# Altium project МПСУ-46342.21-004.PrjPcb
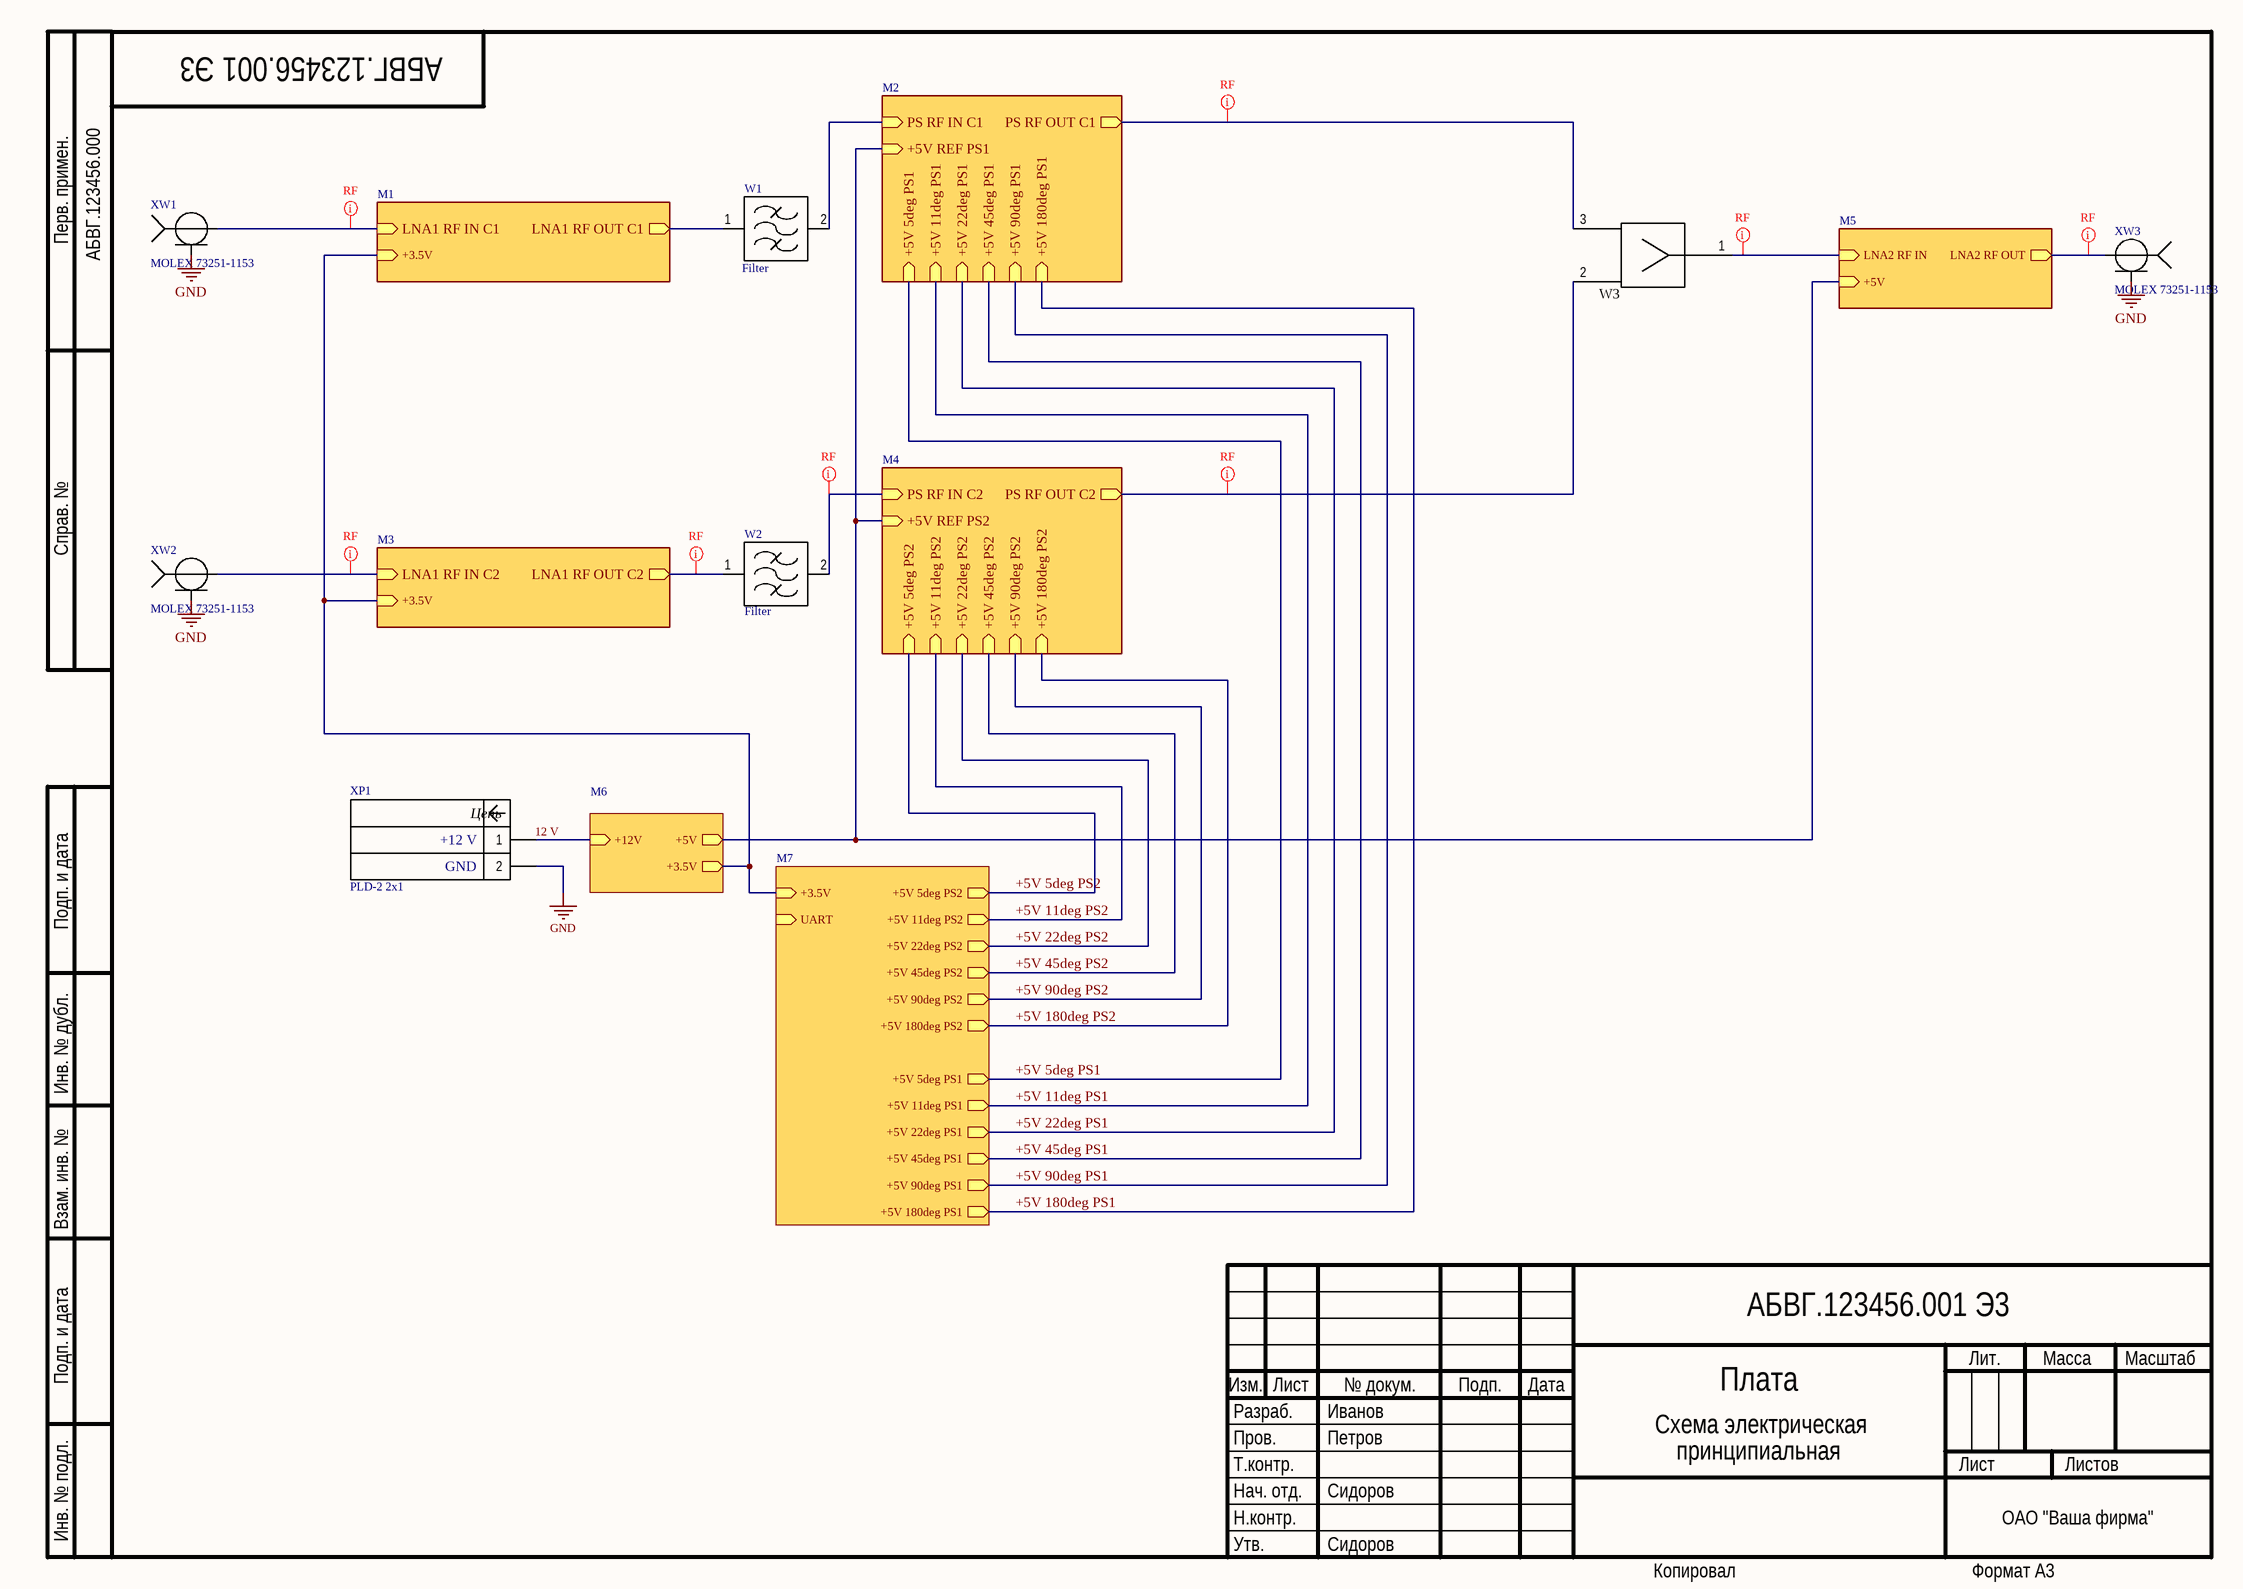
[diagram p0: МПСУ-46342.21-004 Э3 Лист1.SchDoc]
8 sheets, 65 parts. Net scope: hierarchical (ports join the sheet entries above them; power ports are global).
Board file: МПСУ-46342.21-004 Т5М.PcbDoc
Sheets:
  МПСУ-46342.21-004 Э3 Лист1.SchDoc
    M2 = МПСУ-46342.21-004 Э3 Лист4.SchDoc
    M5 = МПСУ-46342.21-004 Э3 Лист3.SchDoc
    M3 = МПСУ-46342.21-004 Э3 Лист7.SchDoc
    M4 = МПСУ-46342.21-004 Э3 Лист8.SchDoc
    M6 = МПСУ-46342.21-004 Э3 Лист5.SchDoc
    M1 = МПСУ-46342.21-004 Э3 Лист2.SchDoc
    M7 = МПСУ-46342.21-004 Э3 Лист6.SchDoc

## Sheet МПСУ-46342.21-004 Э3 Лист1.SchDoc
size 420 x 297 mm; Address1: Address1; Address2: Address2; Address3: Address3; Address4: Address4; SheetNumber: 1; Scale: 1:1; Разраб.: Иванов; Обозначение документа: АБВГ.123456.001 Э3; Пров.: Петров; Утв.: Сидоров; Наименование организации: ОАО "Ваша фирма"; Перв. применение: АБВГ.123456.000; Наименование изделия 1: Плата; Наименование изделия 2: Схема электрическая; Наименование изделия 3: принципиальная; Нач. отд.: Нач. отд.; Фамилия нач. отд.: Сидоров

### Parts
W1  Filter  [Filter]
W2  Filter  [Filter]  (net tie, no BOM)
W3  Wilkinson Coupler  [CouplerWilk]  (value not drawn)  (net tie, no BOM)
XP1  PLD-2 2x1  Net1: +12 V  Net2: GND  [HDRV2W64P254_1X2_254X508H884]
XW1  MOLEX 73251-1153  [MOLEX 73251-1153 - 1.1pin]
XW2  MOLEX 73251-1153  [MOLEX 73251-1153 - 1.1pin]
XW3  MOLEX 73251-1153  [MOLEX 73251-1153 - 1.1pin]

### Sub-sheets
M1 = МПСУ-46342.21-004 Э3 Лист2.SchDoc: +3.5V (in), LNA1 RF IN C1 (in), LNA1 RF OUT C1 (out)
M2 = МПСУ-46342.21-004 Э3 Лист4.SchDoc: PS RF IN C1 (in), PS RF OUT C1 (out), +5V 90deg PS1 (in), +5V 11deg PS1 (in), +5V 45deg PS1 (in), +5V 180deg PS1 (in), +5V REF PS1 (in), +5V 5deg PS1 (in), +5V 22deg PS1 (in)
M3 = МПСУ-46342.21-004 Э3 Лист7.SchDoc: +3.5V (in), LNA1 RF IN C2 (in), LNA1 RF OUT C2 (out)
M4 = МПСУ-46342.21-004 Э3 Лист8.SchDoc: PS RF OUT C2 (out), PS RF IN C2 (in), +5V 5deg PS2 (in), +5V 180deg PS2 (in), +5V 11deg PS2 (in), +5V REF PS2 (in), +5V 22deg PS2 (in), +5V 45deg PS2 (in), +5V 90deg PS2 (in)
M5 = МПСУ-46342.21-004 Э3 Лист3.SchDoc: LNA2 RF IN (in), LNA2 RF OUT (out), +5V (in)
M6 = МПСУ-46342.21-004 Э3 Лист5.SchDoc: +5V (out), +12V (in), +3.5V (out)
M7 = МПСУ-46342.21-004 Э3 Лист6.SchDoc: +3.5V (in), +5V 11deg PS2 (out), +5V 45deg PS1 (out), +5V 90deg PS1 (out), +5V 180deg PS1 (out), +5V 180deg PS2 (out), +5V 5deg PS1 (out), +5V 45deg PS2 (out), +5V 90deg PS2 (out), +5V 5deg PS2 (out), +5V 11deg PS1 (out), +5V 22deg PS1 (out), +5V 22deg PS2 (out), UART (in)

### Nets
GND: XP1.2 XW1.2 XW2.2 XW3.2
12 V: XP1.1 ; sheet M6/+12V
+3.5V: sheet M3/+3.5V, sheet M6/+3.5V, sheet M1/+3.5V, sheet M7/+3.5V
+5V: sheet M2/+5V REF PS1, sheet M5/+5V, sheet M4/+5V REF PS2, sheet M6/+5V
+5V 5deg PS1: sheet M2/+5V 5deg PS1, sheet M7/+5V 5deg PS1
+5V 5deg PS2: sheet M4/+5V 5deg PS2, sheet M7/+5V 5deg PS2
+5V 11deg PS1: sheet M2/+5V 11deg PS1, sheet M7/+5V 11deg PS1
+5V 11deg PS2: sheet M4/+5V 11deg PS2, sheet M7/+5V 11deg PS2
+5V 22deg PS1: sheet M2/+5V 22deg PS1, sheet M7/+5V 22deg PS1
+5V 22deg PS2: sheet M4/+5V 22deg PS2, sheet M7/+5V 22deg PS2
+5V 45deg PS1: sheet M2/+5V 45deg PS1, sheet M7/+5V 45deg PS1
+5V 45deg PS2: sheet M4/+5V 45deg PS2, sheet M7/+5V 45deg PS2
+5V 90deg PS1: sheet M2/+5V 90deg PS1, sheet M7/+5V 90deg PS1
+5V 90deg PS2: sheet M4/+5V 90deg PS2, sheet M7/+5V 90deg PS2
+5V 180deg PS1: sheet M2/+5V 180deg PS1, sheet M7/+5V 180deg PS1
+5V 180deg PS2: sheet M4/+5V 180deg PS2, sheet M7/+5V 180deg PS2
LNA1 RF IN C1: XW1.1 ; sheet M1/LNA1 RF IN C1
LNA1 RF IN C2: XW2.1 ; sheet M3/LNA1 RF IN C2
LNA1 RF OUT C1: W1.1 ; sheet M1/LNA1 RF OUT C1
LNA1 RF OUT C2: W2.1 ; sheet M3/LNA1 RF OUT C2
LNA2 RF IN: W3.1 ; sheet M5/LNA2 RF IN
LNA2 RF OUT: XW3.1 ; sheet M5/LNA2 RF OUT
PS RF IN C1: W1.2 ; sheet M2/PS RF IN C1
PS RF IN C2: W2.2 ; sheet M4/PS RF IN C2
PS RF OUT C1: W3.3 ; sheet M2/PS RF OUT C1
PS RF OUT C2: W3.2 ; sheet M4/PS RF OUT C2

### Layout directives
net class RF: LNA1 RF IN C1, LNA1 RF IN C2, LNA1 RF OUT C2, LNA2 RF IN, LNA2 RF OUT, PS RF IN C2, PS RF OUT C1, PS RF OUT C2

### Notes on the sheet
- Перв. примен.
- Справ. №
- Подп. и дата
- Инв. № дубл.
- Взам. инв. №
- Разраб.
- Изм.
- Лист
- № докум.
- Подп.
- Дата
- Лит.
- Масса
- Масштаб
- Пров.
- Т.контр.
- Листов
- Инв. № подл.
- Утв.
- Н.контр.
- Копировал
- Формат А3
- (in symbol PLD-2) Цепь

### Library data of the parts
W3 = CouplerWilk: Wilkinson Coupler diel 7.2GHz, RO4003, h=0.2mm
XP1 = PLD-2: Header, Vertical, Non-shrouded, 2.54 mm pitch 2x1; PartNumber: PLD-2 2x1
XW1-XW3 = MOLEX 73251-1153: MOLEX 73251-1153 (SMA EDGE); PartNumber: MOLEX 73251-1153; Manufacturer: Molex; ClassName: GNDDirect

## Sheet МПСУ-46342.21-004 Э3 Лист4.SchDoc
size 209 x 297 mm; Address1: Address1; Address2: Address2; Address3: Address3; Address4: Address4; SheetNumber: 1; Scale: 1:1; Разраб.: Иванов; Обозначение документа: АБВГ.123456.001 Э3; Пров.: Петров; Утв.: Сидоров; Наименование организации: ОАО "Ваша фирма"; Перв. применение: АБВГ.123456.000; Наименование изделия 1: Плата; Наименование изделия 2: Схема электрическая; Наименование изделия 3: принципиальная; Нач. отд.: Нач. отд.; Фамилия нач. отд.: Сидоров
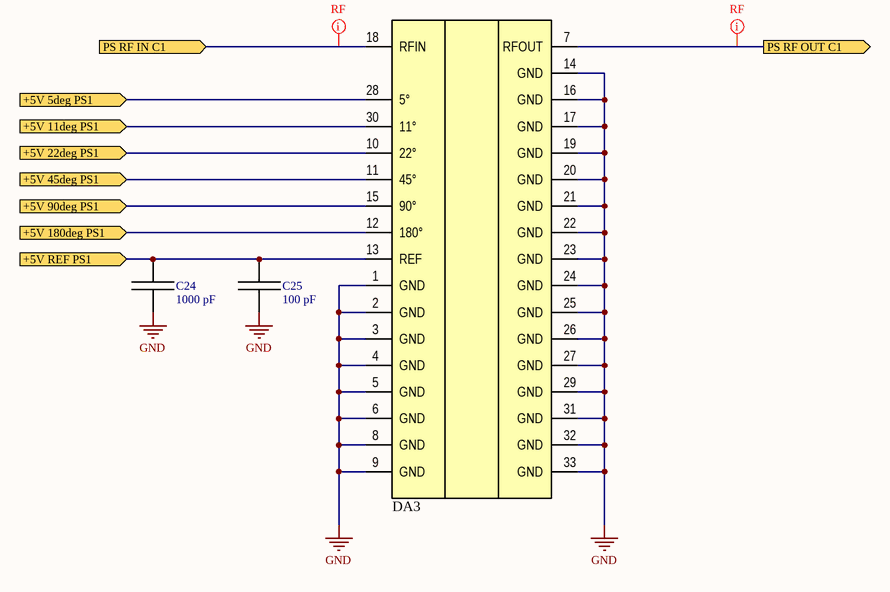
[diagram p1: МПСУ-46342.21-004 Э3 Лист4.SchDoc]

### Parts
C24  1000 pF  [CAPC100X50X55L20N]
C25  100 pF  [CAPC100X50X55L20N]
DA3  TGP2105-SM  [QFN33P50_500X500X80L46X25T340N]  (value not drawn)

### Ports
+5V 5deg PS1 (in), +5V 11deg PS1 (in), +5V 22deg PS1 (in), +5V 45deg PS1 (in), +5V 90deg PS1 (in), +5V 180deg PS1 (in), +5V REF PS1 (in), PS RF IN C1 (in), PS RF OUT C1 (out)

### Nets
GND: C24.1 C25.1 DA3.1(GND) DA3.2(GND) DA3.3(GND) DA3.4(GND) DA3.5(GND) DA3.6(GND) DA3.8(GND) DA3.9(GND) DA3.14(GND) DA3.16(GND) DA3.17(GND) DA3.19(GND) DA3.20(GND) DA3.21(GND) DA3.22(GND) DA3.23(GND) DA3.24(GND) DA3.25(GND) DA3.26(GND) DA3.27(GND) DA3.29(GND) DA3.31(GND) DA3.32(GND) DA3.33(GND)
+5V: C24.2 C25.2 DA3.13(REF) ; port +5V REF PS1
+5V 5deg PS1: DA3.28(5°) ; port +5V 5deg PS1
+5V 11deg PS1: DA3.30(11°) ; port +5V 11deg PS1
+5V 22deg PS1: DA3.10(22°) ; port +5V 22deg PS1
+5V 45deg PS1: DA3.11(45°) ; port +5V 45deg PS1
+5V 90deg PS1: DA3.15(90°) ; port +5V 90deg PS1
+5V 180deg PS1: DA3.12(180°) ; port +5V 180deg PS1
PS RF IN C1: DA3.18(RFIN) ; port PS RF IN C1
PS RF OUT C1: DA3.7(RFOUT) ; port PS RF OUT C1

### Layout directives
net class RF: PS RF IN C1, PS RF OUT C1

### Notes on the sheet
- Перв. примен.
- Справ. №
- Подп. и дата
- Инв. № дубл.
- Взам. инв. №
- Разраб.
- Изм.
- Лист
- № докум.
- Подп.
- Дата
- Лит.
- Масса
- Масштаб
- Пров.
- Т.контр.
- Листов
- Инв. № подл.
- Утв.
- Н.контр.
- Копировал
- Формат А4

### Library data of the parts
C24 C25 = Capacitor: Capacitor, generic; Tolerance: 5 %; VDC: 20 V; PartNumber: *; Dielectric: *; Manufacturer: *; Package: 0402
  C24: Value: 1000 pF
  C25: Value: 100 pF
DA3 = TGP2105-SM 1: 6 - 18 GHz 6-Bit Digital Phase Shifter (+Vc); Manufacturer: Qorvo; PartNumber: TGP2105-SM; ComponentLink1Description: Component Page; ComponentLink1URL: https://www.qorvo.com/products/p/TGP2105-SM

## Sheet МПСУ-46342.21-004 Э3 Лист3.SchDoc
size 297 x 209 mm; Разраб.: Муренков; Пров.: Приходько; Утв.: Приходько; Наименование организации: МПСУ; Наименование изделия 1: Приёмная ячейка; Наименование изделия 2: Схема электрическая; Наименование изделия 3: принципиальная; Нач. отд.: Нач. отд.; Фамилия нач. отд.: Лялин; Address1: Address1; Address2: Address2; Address3: Address3; Address4: Address4; SheetNumber: 3; Scale: 1:1; Обозначение документа: МПСУ-46342.21-004 Э3
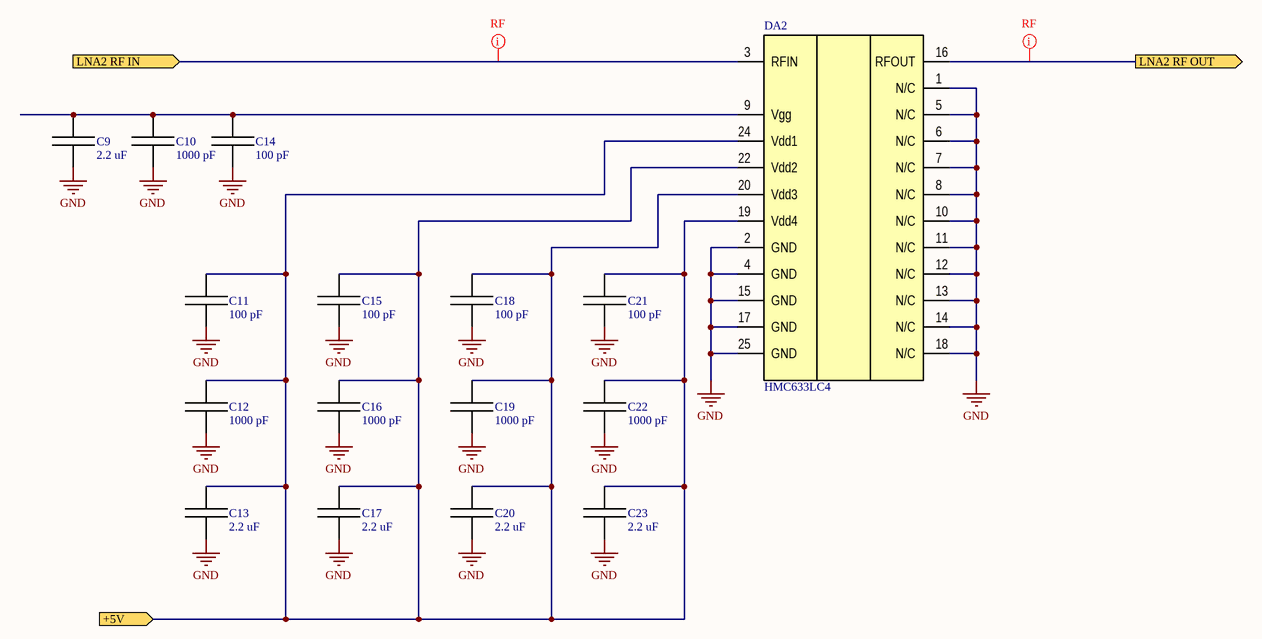
[diagram p2: МПСУ-46342.21-004 Э3 Лист3.SchDoc]

### Parts
C9  2.2 uF  [CAPC100X50X55L20N]
C10  1000 pF  [CAPC100X50X55L20N]
C11  100 pF  [CAPC100X50X55L20N]
C12  1000 pF  [CAPC100X50X55L20N]
C13  2.2 uF  [CAPC160X80X90L30N]
C14  100 pF  [CAPC100X50X55L20N]
C15  100 pF  [CAPC100X50X55L20N]
C16  1000 pF  [CAPC100X50X55L20N]
C17  2.2 uF  [CAPC160X80X90L30N]
C18  100 pF  [CAPC100X50X55L20N]
C19  1000 pF  [CAPC100X50X55L20N]
C20  2.2 uF  [CAPC160X80X90L30N]
C21  100 pF  [CAPC100X50X55L20N]
C22  1000 pF  [CAPC100X50X55L20N]
C23  2.2 uF  [CAPC160X80X90L30N]
DA2  HMC633LC4  [PQFN25P50_390X390X100L32X30T250N]

### Ports
+5V (in), LNA2 RF IN (in), LNA2 RF OUT (out)

### Nets
GND: C9.1 C10.1 C11.1 C12.1 C13.1 C14.1 C15.1 C16.1 C17.1 C18.1 C19.1 C20.1 C21.1 C22.1 C23.1 DA2.1(N/C) DA2.2(GND) DA2.4(GND) DA2.5(N/C) DA2.6(N/C) DA2.7(N/C) DA2.8(N/C) DA2.10(N/C) DA2.11(N/C) DA2.12(N/C) DA2.13(N/C) DA2.14(N/C) DA2.15(GND) DA2.17(GND) DA2.18(N/C) DA2.25(GND)
+5V: C11.2 C12.2 C13.2 C15.2 C16.2 C17.2 C18.2 C19.2 C20.2 C21.2 C22.2 C23.2 DA2.19(Vdd4) DA2.20(Vdd3) DA2.22(Vdd2) DA2.24(Vdd1) ; port +5V
LNA2 RF IN: DA2.3(RFIN) ; port LNA2 RF IN
LNA2 RF OUT: DA2.16(RFOUT) ; port LNA2 RF OUT
NetC9_2: C9.2 C10.2 C14.2 DA2.9(Vgg)

### Layout directives
net class RF: LNA2 RF IN, LNA2 RF OUT

### Notes on the sheet
- Подп. и дата
- Инв. № дубл.
- Взам. инв. №
- Инв. № подл.
- Изм.
- Лист
- № докум.
- Подп.
- Дата
- Копировал
- Формат А4

### Library data of the parts
C9-C23 = Capacitor: as C24 on sheet МПСУ-46342.21-004 Э3 Лист4; PartNumber: *; Dielectric: *; Manufacturer: *
  C9: Value: 2.2 uF; Package: 0402
  C10 C12 C16 C19 C22: Value: 1000 pF; Package: 0402
  C11 C14 C15 C18 C21: Value: 100 pF; Package: 0402
  C13 C17 C20 C23: Value: 2.2 uF; Package: 0603
DA2 = HMC633LC4: GaAs, pHEMT MMIC DRIVERAMPLIFIER, 5.5 - 17 GHz; Manufacturer: Analog Devices; ComponentLink1Description: Component page; ComponentLink1URL: https://www.analog.com/en/products/hmc633lc4.html; PartNumber: HMC633LC4; ClassName: RFCons

## Sheet МПСУ-46342.21-004 Э3 Лист7.SchDoc
size 297 x 209 mm; Address1: Address1; Address2: Address2; Address3: Address3; Address4: Address4; SheetNumber: 1; DocumentTypeSCH: Э3
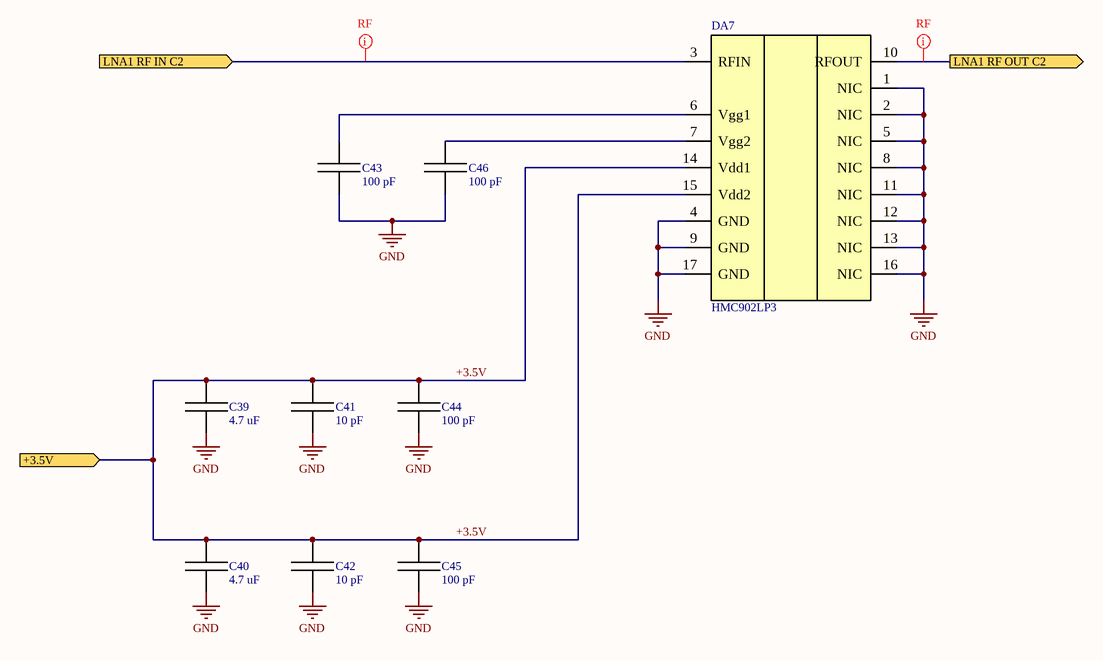
[diagram p3: МПСУ-46342.21-004 Э3 Лист7.SchDoc]

### Parts
C39  4.7 uF  [CAPC160X80X90L30N]
C40  4.7 uF  [CAPC160X80X90L30N]
C41  10 pF  [CAPC100X50X55L20N]
C42  10 pF  [CAPC100X50X55L20N]
C43  100 pF  [CAPC100X50X55L20N]
C44  100 pF  [CAPC100X50X55L20N]
C45  100 pF  [CAPC100X50X55L20N]
C46  100 pF  [CAPC100X50X55L20N]
DA7  HMC902LP3  [QFN17P50_300X300X90L40X25T170N]

### Ports
+3.5V (in), LNA1 RF IN C2 (in), LNA1 RF OUT C2 (out)

### Nets
GND: C39.1 C40.1 C41.1 C42.1 C43.1 C44.1 C45.1 C46.1 DA7.1(NIC) DA7.2(NIC) DA7.4(GND) DA7.5(NIC) DA7.8(NIC) DA7.9(GND) DA7.11(NIC) DA7.12(NIC) DA7.13(NIC) DA7.16(NIC) DA7.17(GND)
+3.5V: C39.2 C40.2 C41.2 C42.2 C44.2 C45.2 DA7.14(Vdd1) DA7.15(Vdd2) ; port +3.5V
LNA1 RF IN C2: DA7.3(RFIN) ; port LNA1 RF IN C2
LNA1 RF OUT C2: DA7.10(RFOUT) ; port LNA1 RF OUT C2
NetC43_2: C43.2 DA7.6(Vgg1)
NetC46_2: C46.2 DA7.7(Vgg2)

### Layout directives
net class RF: LNA1 RF IN C2, LNA1 RF OUT C2

### Notes on the sheet
- Подп. и дата
- Инв. № дубл.
- Взам. инв. №
- Инв. № подл.
- Изм.
- Лист
- № докум.
- Подп.
- Дата
- Копировал
- Формат А4

### Library data of the parts
C39 C40 C43-C46 = Capacitor: as C24 on sheet МПСУ-46342.21-004 Э3 Лист4; PartNumber: *; Dielectric: *; Manufacturer: *
  C39: Value: 4.7 uF; Package: 0603
  C40: Value: 4.7 uF; Package: 0402
  C43-C46: Value: 100 pF; Package: 0402
C41 C42 = Capacitor: Capacitor, generic; Value: 0.01 nF; Tolerance: 5 %; VDC: 20 V; PartNumber: *; Dielectric: *; Manufacturer: *; Package: 0402
DA7 = HMC902LP3: GaAs, pHEMT, MMIC, Low Noise Amplifier, 5 GHz to 11 GHz; Manufacturer: Analog Devices; ComponentLink1Description: Component page; ComponentLink1URL: https://www.analog.com/en/products/hmc902lp3e.html; PartNumber: HMC902LP3; ClassName: RFCons

## Sheet МПСУ-46342.21-004 Э3 Лист8.SchDoc
size 297 x 209 mm; Address1: Address1; Address2: Address2; Address3: Address3; Address4: Address4; SheetNumber: 1; DocumentTypeSCH: Э3
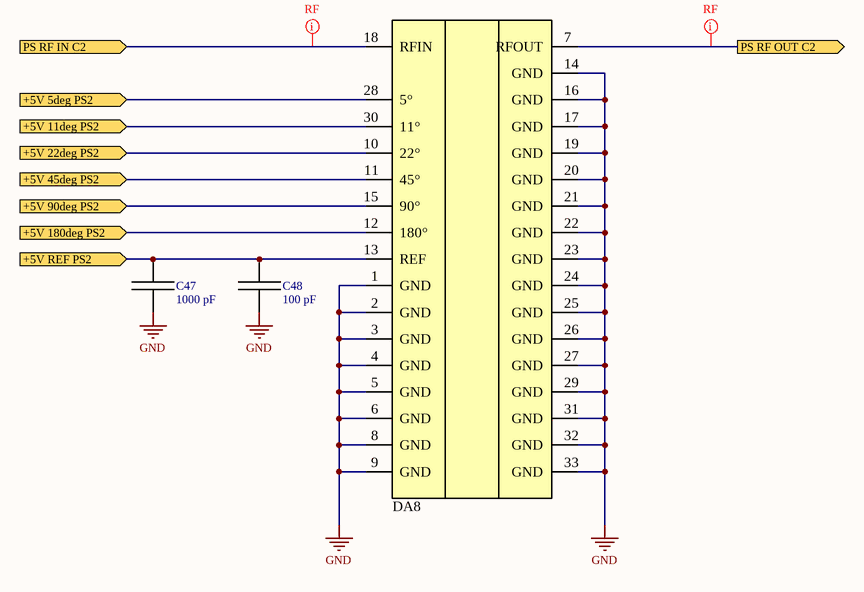
[diagram p4: МПСУ-46342.21-004 Э3 Лист8.SchDoc]

### Parts
C47  1000 pF  [CAPC100X50X55L20N]
C48  100 pF  [CAPC100X50X55L20N]
DA8  TGP2105-SM  [QFN33P50_500X500X80L46X25T340N]  (value not drawn)

### Ports
+5V 5deg PS2 (in), +5V 11deg PS2 (in), +5V 22deg PS2 (in), +5V 45deg PS2 (in), +5V 90deg PS2 (in), +5V 180deg PS2 (in), +5V REF PS2 (in), PS RF IN C2 (in), PS RF OUT C2 (out)

### Nets
GND: C47.1 C48.1 DA8.1(GND) DA8.2(GND) DA8.3(GND) DA8.4(GND) DA8.5(GND) DA8.6(GND) DA8.8(GND) DA8.9(GND) DA8.14(GND) DA8.16(GND) DA8.17(GND) DA8.19(GND) DA8.20(GND) DA8.21(GND) DA8.22(GND) DA8.23(GND) DA8.24(GND) DA8.25(GND) DA8.26(GND) DA8.27(GND) DA8.29(GND) DA8.31(GND) DA8.32(GND) DA8.33(GND)
+5V: C47.2 C48.2 DA8.13(REF) ; port +5V REF PS2
+5V 5deg PS2: DA8.28(5°) ; port +5V 5deg PS2
+5V 11deg PS2: DA8.30(11°) ; port +5V 11deg PS2
+5V 22deg PS2: DA8.10(22°) ; port +5V 22deg PS2
+5V 45deg PS2: DA8.11(45°) ; port +5V 45deg PS2
+5V 90deg PS2: DA8.15(90°) ; port +5V 90deg PS2
+5V 180deg PS2: DA8.12(180°) ; port +5V 180deg PS2
PS RF IN C2: DA8.18(RFIN) ; port PS RF IN C2
PS RF OUT C2: DA8.7(RFOUT) ; port PS RF OUT C2

### Layout directives
net class RF: PS RF IN C2, PS RF OUT C2

### Notes on the sheet
- Подп. и дата
- Инв. № дубл.
- Взам. инв. №
- Инв. № подл.
- Изм.
- Лист
- № докум.
- Подп.
- Дата
- Копировал
- Формат А4

### Library data of the parts
C47 C48 = Capacitor: as C24 on sheet МПСУ-46342.21-004 Э3 Лист4; PartNumber: *; Dielectric: *; Manufacturer: *; Package: 0402
  C47: Value: 1000 pF
  C48: Value: 100 pF
DA8 = TGP2105-SM 1: as DA3 on sheet МПСУ-46342.21-004 Э3 Лист4; PartNumber: TGP2105-SM; ComponentLink1Description: Component Page; ComponentLink1URL: https://www.qorvo.com/products/p/TGP2105-SM

## Sheet МПСУ-46342.21-004 Э3 Лист5.SchDoc
size 209 x 297 mm; Address1: Address1; Address2: Address2; Address3: Address3; Address4: Address4; SheetNumber: 1; Scale: 1:1; Разраб.: Муренков; Обозначение документа: МПСУ-46342.21-004 Э3; Пров.: Приходько; Номер листа: 1; Общее количество листов: 2; Литера: У; Наименование организации: МПСУ; Наименование изделия 1: Приёмная ячейка; Наименование изделия 2: Схема электрическая; Наименование изделия 3: принципиальная; Нач. отд.: Нач. отд.; Фамилия нач. отд.: Лялин
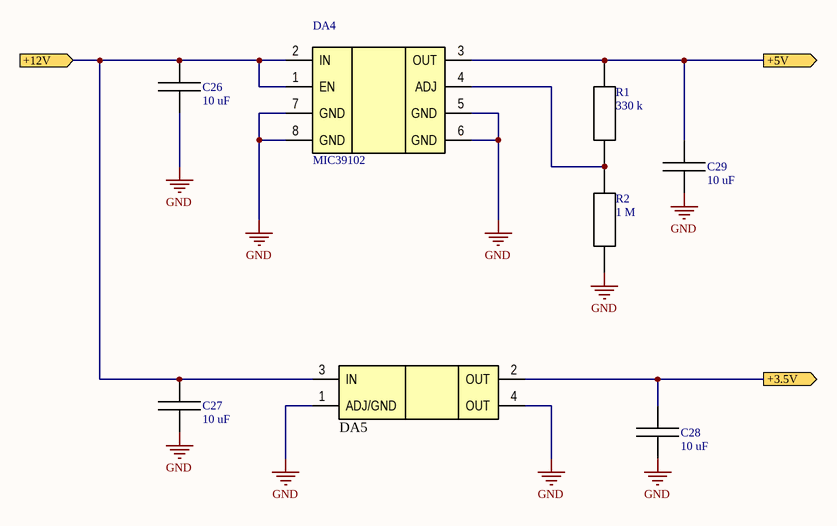
[diagram p5: МПСУ-46342.21-004 Э3 Лист5.SchDoc]

### Parts
C26  10 uF  [CAPC100X50X55L20N]
C27  10 uF  [CAPC100X50X55L20N]
C28  10 uF  [CAPC100X50X55L20N]
C29  10 uF  [CAPC100X50X55L20N]
DA4  MIC39102  [SOIC127P600X160-8N]
DA5  NCP1117LPST50T3G  [SOT223-4P230_700X180L92X74N]  (value not drawn)
R1  330 k  [RESC100X50X40L25N]
R2  1 M  [RESC100X50X40L25N]

### Ports
+3.5V (out), +5V (out), +12V (in)

### Nets
GND: C26.1 C27.1 C28.1 C29.1 DA4.5(GND) DA4.6(GND) DA4.7(GND) DA4.8(GND) DA5.1(ADJ/GND) DA5.4(OUT) R2.1
12 V: C26.2 C27.2 DA4.1(EN) DA4.2(IN) DA5.3(IN) ; port +12V
+3.5V: C28.2 DA5.2(OUT) ; port +3.5V
+5V: C29.2 DA4.3(OUT) R1.2 ; port +5V
NetDA4_4: DA4.4(ADJ) R1.1 R2.2

### Notes on the sheet
- Перв. примен.
- Справ. №
- Подп. и дата
- Инв. № дубл.
- Взам. инв. №
- Разраб.
- Изм.
- Лист
- № докум.
- Подп.
- Дата
- Лит.
- Масса
- Масштаб
- Пров.
- Т.контр.
- Листов
- Инв. № подл.
- Утв.
- Н.контр.
- Копировал
- Формат А4
- (in symbol MIC39102) Text

### Library data of the parts
C26-C29 = Capacitor: as C24 on sheet МПСУ-46342.21-004 Э3 Лист4; Value: 10 uF; PartNumber: *; Dielectric: *; Manufacturer: *; Package: 0402
DA4 = MIC39102: 1A Low-Voltage Low-Dropout Regulator, Adj; Manufacturer: Microchip; PartNumber: MIC39102
DA5 = NCP1117LP: 1.0 A Low-Dropout Positive / Fixed and Adjustable / Voltage Regulators; Manufacturer: On Semiconductor; PartNumber: NCP1117LPST50T3G
R1 = Resistor: Resistor, generic; Value: 330 k; PartNumber: *; Tolerance: *; Power: *; DCV: *; Manufacturer: *; Package: 0402
R2 = Resistor: Resistor, generic; Tolerance: 5 %; Power: 20 V; Value: 1 M; PartNumber: *; DCV: *; Manufacturer: *; Package: 0402

## Sheet МПСУ-46342.21-004 Э3 Лист2.SchDoc
size 297 x 209 mm; Address1: Address1; Address2: Address2; Address3: Address3; Address4: Address4; SheetNumber: 2; Scale: 1:1; Обозначение документа: МПСУ-46342.21-004 Э3
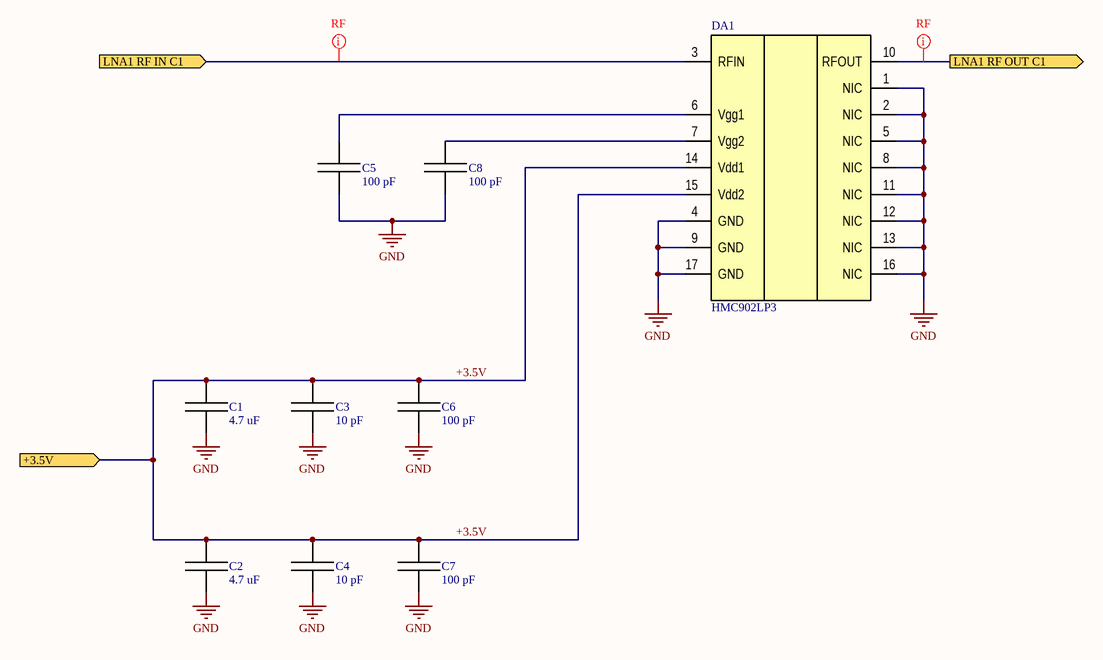
[diagram p6: МПСУ-46342.21-004 Э3 Лист2.SchDoc]

### Parts
C1  4.7 uF  [CAPC160X80X90L30N]
C2  4.7 uF  [CAPC160X80X90L30N]
C3  10 pF  [CAPC100X50X55L20N]
C4  10 pF  [CAPC100X50X55L20N]
C5  100 pF  [CAPC100X50X55L20N]
C6  100 pF  [CAPC100X50X55L20N]
C7  100 pF  [CAPC100X50X55L20N]
C8  100 pF  [CAPC100X50X55L20N]
DA1  HMC902LP3  [QFN17P50_300X300X90L40X25T170N]

### Ports
+3.5V (in), LNA1 RF IN C1 (in), LNA1 RF OUT C1 (out)

### Nets
GND: C1.1 C2.1 C3.1 C4.1 C5.1 C6.1 C7.1 C8.1 DA1.1(NIC) DA1.2(NIC) DA1.4(GND) DA1.5(NIC) DA1.8(NIC) DA1.9(GND) DA1.11(NIC) DA1.12(NIC) DA1.13(NIC) DA1.16(NIC) DA1.17(GND)
+3.5V: C1.2 C2.2 C3.2 C4.2 C6.2 C7.2 DA1.14(Vdd1) DA1.15(Vdd2) ; port +3.5V
LNA1 RF IN C1: DA1.3(RFIN) ; port LNA1 RF IN C1
LNA1 RF OUT C1: DA1.10(RFOUT) ; port LNA1 RF OUT C1
NetC5_2: C5.2 DA1.6(Vgg1)
NetC8_2: C8.2 DA1.7(Vgg2)

### Layout directives
net class RF: LNA1 RF IN C1, LNA1 RF OUT C1

### Notes on the sheet
- Подп. и дата
- Инв. № дубл.
- Взам. инв. №
- Инв. № подл.
- Изм.
- Лист
- № докум.
- Подп.
- Дата
- Копировал
- Формат А4

### Library data of the parts
C1 C2 C5-C8 = Capacitor: as C24 on sheet МПСУ-46342.21-004 Э3 Лист4; PartNumber: *; Dielectric: *; Manufacturer: *
  C1: Value: 4.7 uF; Package: 0603
  C2: Value: 4.7 uF; Package: 0402
  C5-C8: Value: 100 pF; Package: 0402
C3 C4 = Capacitor: as C41 on sheet МПСУ-46342.21-004 Э3 Лист7; PartNumber: *; Dielectric: *; Manufacturer: *; Package: 0402
DA1 = HMC902LP3: as DA7 on sheet МПСУ-46342.21-004 Э3 Лист7; ComponentLink1Description: Component page; ComponentLink1URL: https://www.analog.com/en/products/hmc902lp3e.html; PartNumber: HMC902LP3; ClassName: RFCons

## Sheet МПСУ-46342.21-004 Э3 Лист6.SchDoc
size 297 x 209 mm; Address1: Address1; Address2: Address2; Address3: Address3; Address4: Address4; SheetNumber: 1; Scale: 1:1; Обозначение документа: АБВГ.123456.001 Э3
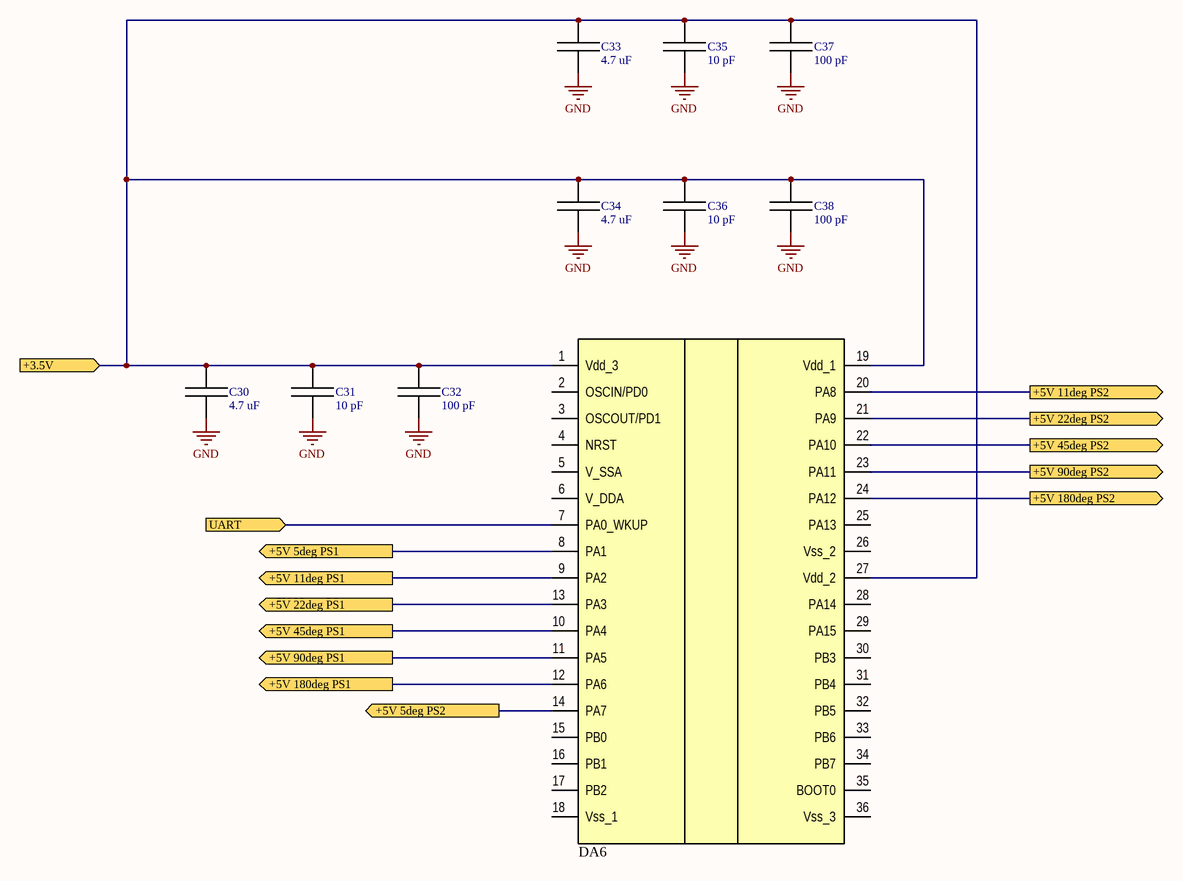
[diagram p7: МПСУ-46342.21-004 Э3 Лист6.SchDoc]

### Parts
C30  4.7 uF  [CAPC100X50X55L20N]
C31  10 pF  [CAPC100X50X55L20N]
C32  100 pF  [CAPC100X50X55L20N]
C33  4.7 uF  [CAPC100X50X55L20N]
C34  4.7 uF  [CAPC100X50X55L20N]
C35  10 pF  [CAPC100X50X55L20N]
C36  10 pF  [CAPC100X50X55L20N]
C37  100 pF  [CAPC100X50X55L20N]
C38  100 pF  [CAPC100X50X55L20N]
DA6  (no value)  [QFN50P600X600X90_HS-37N]

### Ports
+3.5V (in), +5V 5deg PS1 (out), +5V 5deg PS2 (out), +5V 11deg PS1 (out), +5V 11deg PS2 (out), +5V 22deg PS1 (out), +5V 22deg PS2 (out), +5V 45deg PS1 (out), +5V 45deg PS2 (out), +5V 90deg PS1 (out), +5V 90deg PS2 (out), +5V 180deg PS1 (out), +5V 180deg PS2 (out), UART (in)

### Nets
GND: C30.1 C31.1 C32.1 C33.1 C34.1 C35.1 C36.1 C37.1 C38.1
+3.5V: C30.2 C31.2 C32.2 C33.2 C34.2 C35.2 C36.2 C37.2 C38.2 DA6.1(Vdd_3) DA6.19(Vdd_1) DA6.27(Vdd_2) ; port +3.5V
+5V 5deg PS1: DA6.8(PA1) ; port +5V 5deg PS1
+5V 5deg PS2: DA6.14(PA7) ; port +5V 5deg PS2
+5V 11deg PS1: DA6.9(PA2) ; port +5V 11deg PS1
+5V 11deg PS2: DA6.20(PA8) ; port +5V 11deg PS2
+5V 22deg PS1: DA6.13(PA3) ; port +5V 22deg PS1
+5V 22deg PS2: DA6.21(PA9) ; port +5V 22deg PS2
+5V 45deg PS1: DA6.10(PA4) ; port +5V 45deg PS1
+5V 45deg PS2: DA6.22(PA10) ; port +5V 45deg PS2
+5V 90deg PS1: DA6.11(PA5) ; port +5V 90deg PS1
+5V 90deg PS2: DA6.23(PA11) ; port +5V 90deg PS2
+5V 180deg PS1: DA6.12(PA6) ; port +5V 180deg PS1
+5V 180deg PS2: DA6.24(PA12) ; port +5V 180deg PS2
UART: DA6.7(PA0_WKUP) ; port UART

Not connected (* = marked no-connect by the designer): DA6 2(OSCIN/PD0) 3(OSCOUT/PD1) 4(NRST) 5(V_SSA) 6(V_DDA) 15(PB0) 16(PB1) 17(PB2) 18(Vss_1) 25(PA13) 26(Vss_2) 28(PA14) 29(PA15) 30(PB3) 31(PB4) 32(PB5) 33(PB6) 34(PB7) 35(BOOT0) 36(Vss_3)

### Notes on the sheet
- Подп. и дата
- Инв. № дубл.
- Взам. инв. №
- Инв. № подл.
- Изм.
- Лист
- № докум.
- Подп.
- Дата
- Копировал
- Формат А4

### Library data of the parts
C30-C38 = Capacitor: as C24 on sheet МПСУ-46342.21-004 Э3 Лист4; PartNumber: *; Dielectric: *; Manufacturer: *; Package: 0402
  C30 C33 C34: Value: 4.7 uF
  C31 C35 C36: Value: 10 pF
  C32 C37 C38: Value: 100 pF
DA6 = GD32VF103Tx

## Nets that join several sheets
GND: МПСУ-46342.21-004 Э3 Лист1 (XP1.2 XW1.2 XW2.2 XW3.2), МПСУ-46342.21-004 Э3 Лист4 (26 pins), МПСУ-46342.21-004 Э3 Лист3 (31 pins), МПСУ-46342.21-004 Э3 Лист7 (19 pins), МПСУ-46342.21-004 Э3 Лист8 (26 pins), МПСУ-46342.21-004 Э3 Лист5 (11 pins), МПСУ-46342.21-004 Э3 Лист2 (19 pins), МПСУ-46342.21-004 Э3 Лист6 (9 pins)
12 V: МПСУ-46342.21-004 Э3 Лист1 (XP1.1), МПСУ-46342.21-004 Э3 Лист5 (5 pins)
+3.5V: МПСУ-46342.21-004 Э3 Лист7 (8 pins), МПСУ-46342.21-004 Э3 Лист5 (C28.2 DA5.2), МПСУ-46342.21-004 Э3 Лист2 (8 pins), МПСУ-46342.21-004 Э3 Лист6 (12 pins)
+5V: МПСУ-46342.21-004 Э3 Лист4 (C24.2 C25.2 DA3.13), МПСУ-46342.21-004 Э3 Лист3 (16 pins), МПСУ-46342.21-004 Э3 Лист8 (C47.2 C48.2 DA8.13), МПСУ-46342.21-004 Э3 Лист5 (C29.2 DA4.3 R1.2)
+5V 5deg PS1: МПСУ-46342.21-004 Э3 Лист4 (DA3.28), МПСУ-46342.21-004 Э3 Лист6 (DA6.8)
+5V 5deg PS2: МПСУ-46342.21-004 Э3 Лист8 (DA8.28), МПСУ-46342.21-004 Э3 Лист6 (DA6.14)
+5V 11deg PS1: МПСУ-46342.21-004 Э3 Лист4 (DA3.30), МПСУ-46342.21-004 Э3 Лист6 (DA6.9)
+5V 11deg PS2: МПСУ-46342.21-004 Э3 Лист8 (DA8.30), МПСУ-46342.21-004 Э3 Лист6 (DA6.20)
+5V 22deg PS1: МПСУ-46342.21-004 Э3 Лист4 (DA3.10), МПСУ-46342.21-004 Э3 Лист6 (DA6.13)
+5V 22deg PS2: МПСУ-46342.21-004 Э3 Лист8 (DA8.10), МПСУ-46342.21-004 Э3 Лист6 (DA6.21)
+5V 45deg PS1: МПСУ-46342.21-004 Э3 Лист4 (DA3.11), МПСУ-46342.21-004 Э3 Лист6 (DA6.10)
+5V 45deg PS2: МПСУ-46342.21-004 Э3 Лист8 (DA8.11), МПСУ-46342.21-004 Э3 Лист6 (DA6.22)
+5V 90deg PS1: МПСУ-46342.21-004 Э3 Лист4 (DA3.15), МПСУ-46342.21-004 Э3 Лист6 (DA6.11)
+5V 90deg PS2: МПСУ-46342.21-004 Э3 Лист8 (DA8.15), МПСУ-46342.21-004 Э3 Лист6 (DA6.23)
+5V 180deg PS1: МПСУ-46342.21-004 Э3 Лист4 (DA3.12), МПСУ-46342.21-004 Э3 Лист6 (DA6.12)
+5V 180deg PS2: МПСУ-46342.21-004 Э3 Лист8 (DA8.12), МПСУ-46342.21-004 Э3 Лист6 (DA6.24)
LNA1 RF IN C1: МПСУ-46342.21-004 Э3 Лист1 (XW1.1), МПСУ-46342.21-004 Э3 Лист2 (DA1.3)
LNA1 RF IN C2: МПСУ-46342.21-004 Э3 Лист1 (XW2.1), МПСУ-46342.21-004 Э3 Лист7 (DA7.3)
LNA1 RF OUT C1: МПСУ-46342.21-004 Э3 Лист1 (W1.1), МПСУ-46342.21-004 Э3 Лист2 (DA1.10)
LNA1 RF OUT C2: МПСУ-46342.21-004 Э3 Лист1 (W2.1), МПСУ-46342.21-004 Э3 Лист7 (DA7.10)
LNA2 RF IN: МПСУ-46342.21-004 Э3 Лист1 (W3.1), МПСУ-46342.21-004 Э3 Лист3 (DA2.3)
LNA2 RF OUT: МПСУ-46342.21-004 Э3 Лист1 (XW3.1), МПСУ-46342.21-004 Э3 Лист3 (DA2.16)
PS RF IN C1: МПСУ-46342.21-004 Э3 Лист1 (W1.2), МПСУ-46342.21-004 Э3 Лист4 (DA3.18)
PS RF IN C2: МПСУ-46342.21-004 Э3 Лист1 (W2.2), МПСУ-46342.21-004 Э3 Лист8 (DA8.18)
PS RF OUT C1: МПСУ-46342.21-004 Э3 Лист1 (W3.3), МПСУ-46342.21-004 Э3 Лист4 (DA3.7)
PS RF OUT C2: МПСУ-46342.21-004 Э3 Лист1 (W3.2), МПСУ-46342.21-004 Э3 Лист8 (DA8.7)